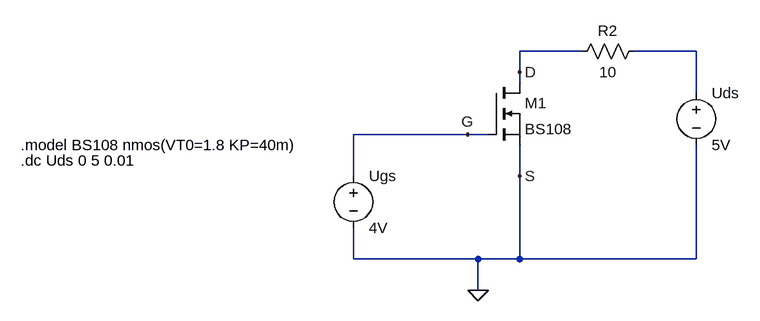
[diagram p0: schematic MOSFETOutputCharacteristicsCircuit.asc]
MOSFETOutputCharacteristicsCircuit.asc, the LTspice schematic file:
Version 4
SHEET 1 880 680
WIRE 288 64 192 64
WIRE 464 64 368 64
WIRE 192 96 192 64
WIRE 192 112 192 96
WIRE 464 128 464 64
WIRE 112 192 -64 192
WIRE 144 192 112 192
WIRE -64 256 -64 192
WIRE 192 256 192 208
WIRE -64 384 -64 336
WIRE 128 384 -64 384
WIRE 192 384 192 256
WIRE 192 384 128 384
WIRE 464 384 464 208
WIRE 464 384 192 384
WIRE 128 432 128 384
FLAG 128 432 0
FLAG 192 96 D
FLAG 112 192 G
FLAG 192 256 S
SYMBOL nmos 144 112 R0
SYMATTR InstName M1
SYMATTR Value BS108
SYMBOL voltage 464 112 R0
WINDOW 123 0 0 Left 0
WINDOW 39 0 0 Left 0
SYMATTR InstName Uds
SYMATTR Value 5V
SYMBOL voltage -64 240 R0
WINDOW 123 0 0 Left 0
WINDOW 39 0 0 Left 0
SYMATTR InstName Ugs
SYMATTR Value 4V
SYMBOL res 384 48 R90
WINDOW 0 0 56 VBottom 2
WINDOW 3 32 56 VTop 2
SYMATTR InstName R2
SYMATTR Value 10
TEXT -576 232 Left 2 !.dc Uds 0 5 0.01
TEXT -576 208 Left 2 !.model BS108 nmos(VT0=1.8 KP=40m)

The netlist it stands for:
* MOSFETOutputCharacteristicsCircuit.asc
M1 D G 0 0 BS108
V§Uds N001 0 5V
V§Ugs G 0 4V
R2 N001 D 10
.model NMOS NMOS
.model PMOS PMOS
.lib standard.mos
.dc Uds 0 5 0.01
.model BS108 nmos(VT0=1.8 KP=40m)
.backanno
.end